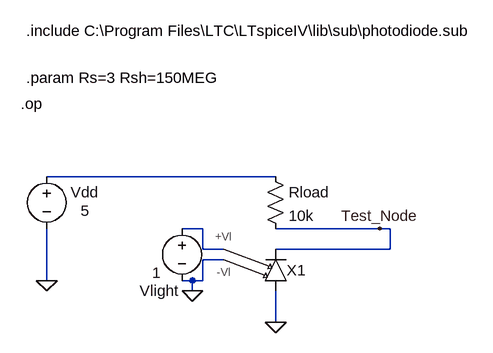
[diagram p0: schematic Photodiode_Test.asc]
Photodiode_Test.asc, the LTspice schematic file:
Version 4
SHEET 1 916 680
WIRE 272 48 -80 48
WIRE 160 128 128 128
WIRE 432 128 272 128
WIRE 448 128 432 128
WIRE 160 160 160 128
WIRE 192 160 160 160
WIRE 448 160 448 128
WIRE 448 160 272 160
WIRE 192 176 160 176
WIRE -80 208 -80 128
WIRE 144 208 128 208
WIRE 160 208 160 176
WIRE 160 208 144 208
WIRE 144 224 144 208
WIRE 272 272 272 224
FLAG 144 224 0
FLAG -80 208 0
FLAG 272 272 0
FLAG 432 128 Test_Node
SYMBOL voltage -80 32 R0
WINDOW 123 0 0 Left 2
WINDOW 39 0 0 Left 2
WINDOW 0 37 40 Left 2
WINDOW 3 52 69 Left 2
SYMATTR InstName Vdd
SYMATTR Value 5
SYMBOL voltage 128 112 M0
WINDOW 123 0 0 Left 2
WINDOW 39 0 0 Left 2
WINDOW 0 5 112 Left 2
WINDOW 3 32 84 Left 2
SYMATTR InstName Vlight
SYMATTR Value 1
SYMBOL res 256 32 R0
SYMATTR InstName Rload
SYMATTR Value 10k
SYMBOL mysymbols\\photodiode 272 208 R0
WINDOW 0 17 -16 Left 2
SYMATTR InstName X1
TEXT -112 -104 Left 2 !.param Rs=3 Rsh=150MEG
TEXT -112 -176 Left 2 !.include C:\\Program Files\\LTC\\LTspiceIV\\lib\\sub\\photodiode.sub
TEXT -120 -64 Left 2 !.op

The netlist it stands for:
* Photodiode_Test.asc
Vdd N001 0 5
Vlight N002 0 1
Rload N001 Test_Node 10k
XX1 Test_Node 0 N002 0 photodiode  ; pins Cathode Anode +Vl -Vl
.param Rs=3 Rsh=150MEG
.include C:\Program Files\LTC\LTspiceIV\lib\sub\photodiode.sub
.op
.backanno
.end